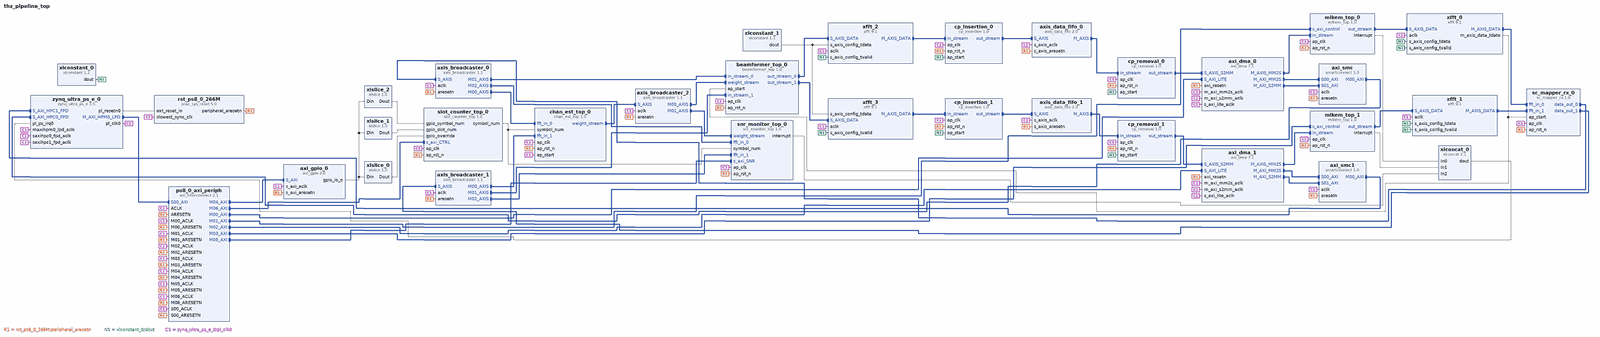
[diagram p0: block diagram of the top level, whole]
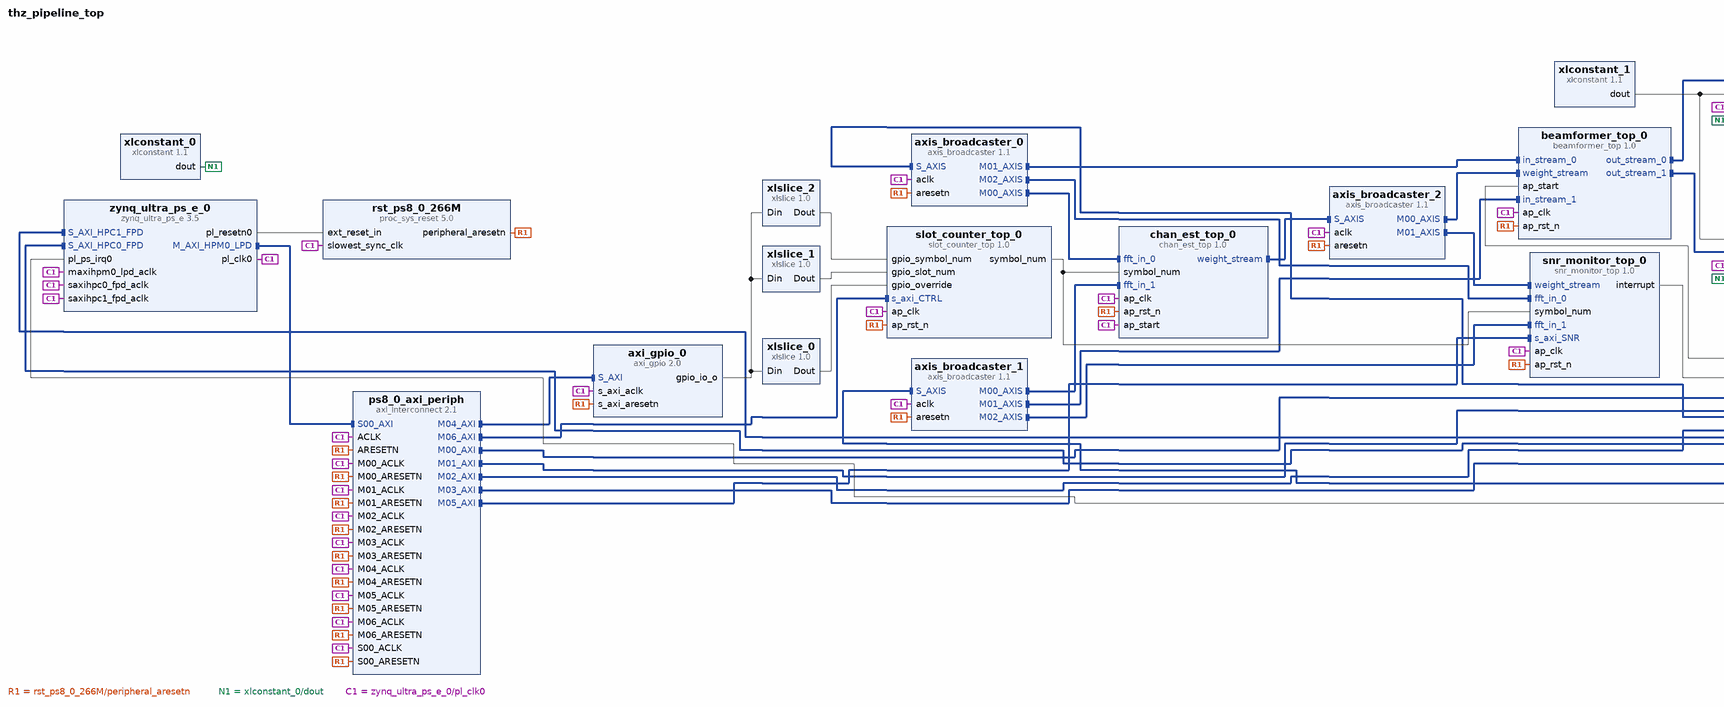
[diagram p1: block diagram of the top level, left part]
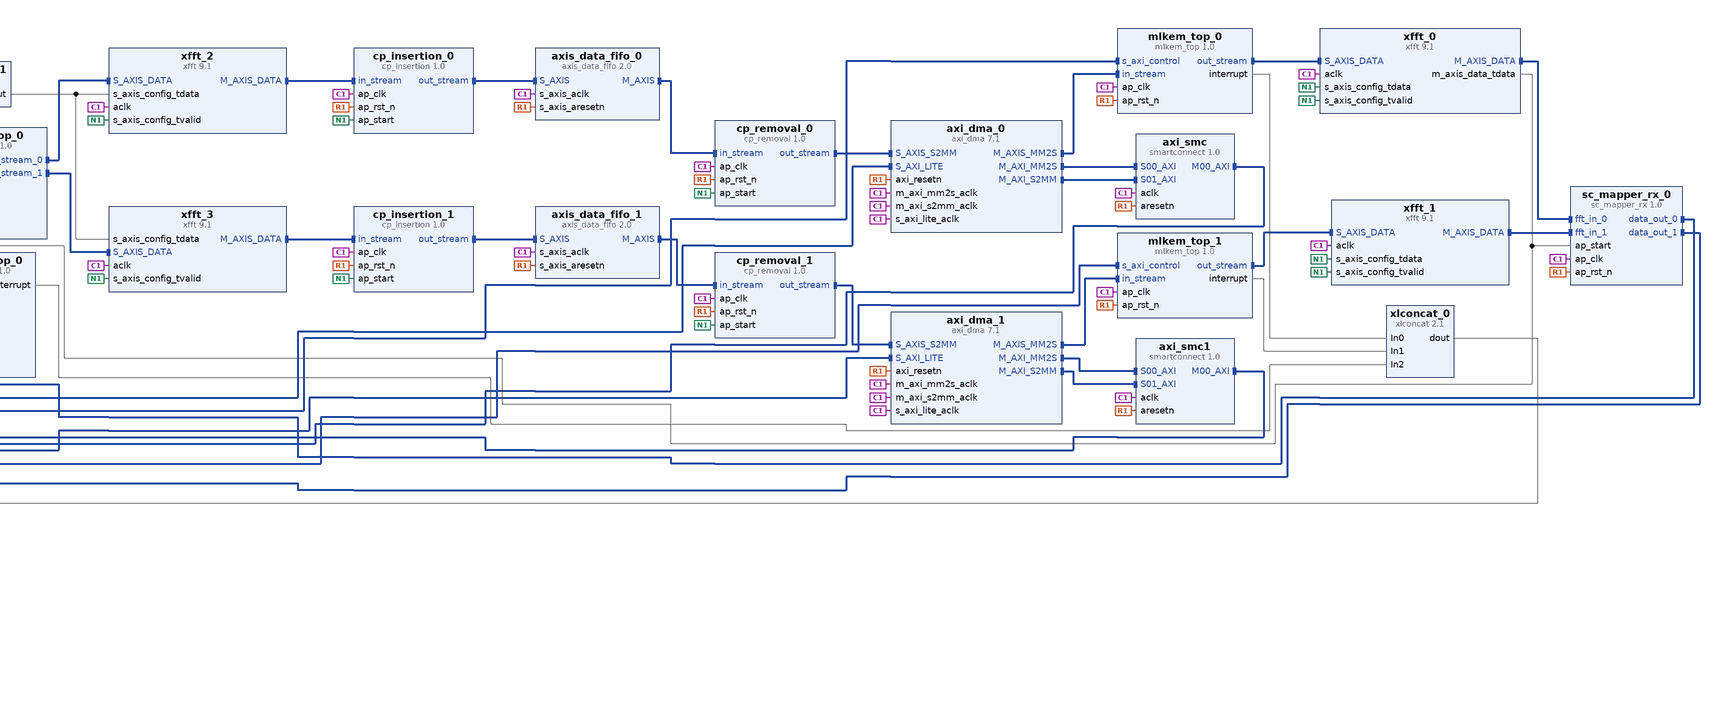
[diagram p2: block diagram of the top level, right part]
# Vivado block design thz_pipeline_top, xczu7ev-ffvc1156-2-e, Vivado 2024.1
create_bd_design thz_pipeline_top

create_bd_cell -type ip -vlnv xilinx.com:ip:smartconnect:1.0 axi_smc
set_property -dict {CONFIG.NUM_SI 2} [get_bd_cells axi_smc]
create_bd_cell -type ip -vlnv xilinx.com:ip:zynq_ultra_ps_e:3.5 zynq_ultra_ps_e_0
set_property -dict [list \
  CONFIG.PSU__CRL_APB__PL0_REF_CTRL__FREQMHZ 300 \
  CONFIG.PSU__CRL_APB__PL0_REF_CTRL__SRCSEL IOPLL \
  CONFIG.PSU__DDR_HIGH_ADDRESS_GUI_ENABLE 0 \
  CONFIG.PSU__OVERRIDE__BASIC_CLOCK 0 \
  CONFIG.PSU__USE__IRQ0 1 \
  CONFIG.PSU__USE__S_AXI_GP0 1 \
  CONFIG.PSU__USE__S_AXI_GP1 1 \
] [get_bd_cells zynq_ultra_ps_e_0]
# 31 more settings of zynq_ultra_ps_e_0 are not shown: defaults, MIO pin electricals, DDR timing, and values the tool derives
create_bd_cell -type ip -vlnv xilinx.com:ip:xfft:9.1 xfft_0
set_property -dict {CONFIG.run_time_configurable_transform_length true CONFIG.throttle_scheme realtime} [get_bd_cells xfft_0]
create_bd_cell -type ip -vlnv xilinx.com:ip:xlconstant:1.1 xlconstant_0
create_bd_cell -type ip -vlnv xilinx.com:ip:proc_sys_reset:5.0 rst_ps8_0_266M
create_bd_cell -type ip -vlnv xilinx.com:ip:axi_interconnect:2.1 ps8_0_axi_periph
set_property -dict {CONFIG.NUM_MI 7} [get_bd_cells ps8_0_axi_periph]
create_bd_cell -type ip -vlnv xilinx.com:ip:axis_data_fifo:2.0 axis_data_fifo_0
set_property -dict {CONFIG.FIFO_DEPTH 1024} [get_bd_cells axis_data_fifo_0]
create_bd_cell -type ip -vlnv xilinx.com:ip:xfft:9.1 xfft_1
set_property -dict {CONFIG.run_time_configurable_transform_length true CONFIG.throttle_scheme realtime} [get_bd_cells xfft_1]
create_bd_cell -type ip -vlnv xilinx.com:ip:axi_dma:7.1 axi_dma_0
set_property -dict {CONFIG.c_addr_width 40 CONFIG.c_include_sg 0 CONFIG.c_micro_dma 0} [get_bd_cells axi_dma_0]
create_bd_cell -type ip -vlnv xilinx.com:hls:mlkem_top:1.0 mlkem_top_0
create_bd_cell -type ip -vlnv xilinx.com:hls:mlkem_top:1.0 mlkem_top_1
create_bd_cell -type ip -vlnv xilinx.com:ip:axi_dma:7.1 axi_dma_1
set_property -dict {CONFIG.c_addr_width 40 CONFIG.c_include_sg 0 CONFIG.c_micro_dma 0} [get_bd_cells axi_dma_1]
create_bd_cell -type ip -vlnv xilinx.com:ip:smartconnect:1.0 axi_smc1
set_property -dict {CONFIG.NUM_SI 2} [get_bd_cells axi_smc1]
create_bd_cell -type ip -vlnv xilinx.com:ip:axis_data_fifo:2.0 axis_data_fifo_1
set_property -dict {CONFIG.FIFO_DEPTH 1024} [get_bd_cells axis_data_fifo_1]
create_bd_cell -type ip -vlnv xilinx.com:hls:beamformer_top:1.0 beamformer_top_0
create_bd_cell -type ip -vlnv xilinx.com:hls:cp_removal:1.0 cp_removal_0
create_bd_cell -type ip -vlnv xilinx.com:hls:cp_removal:1.0 cp_removal_1
create_bd_cell -type ip -vlnv xilinx.com:ip:xfft:9.1 xfft_2
set_property -dict {CONFIG.run_time_configurable_transform_length true CONFIG.throttle_scheme realtime} [get_bd_cells xfft_2]
create_bd_cell -type ip -vlnv xilinx.com:ip:xfft:9.1 xfft_3
set_property -dict {CONFIG.run_time_configurable_transform_length true CONFIG.throttle_scheme realtime} [get_bd_cells xfft_3]
create_bd_cell -type ip -vlnv xilinx.com:ip:xlconstant:1.1 xlconstant_1
set_property -dict {CONFIG.CONST_VAL 0} [get_bd_cells xlconstant_1]
create_bd_cell -type ip -vlnv xilinx.com:hls:cp_insertion:1.0 cp_insertion_0
create_bd_cell -type ip -vlnv xilinx.com:hls:cp_insertion:1.0 cp_insertion_1
create_bd_cell -type ip -vlnv xilinx.com:ip:axis_broadcaster:1.1 axis_broadcaster_0
set_property -dict {CONFIG.NUM_MI 3} [get_bd_cells axis_broadcaster_0]
create_bd_cell -type ip -vlnv xilinx.com:ip:axis_broadcaster:1.1 axis_broadcaster_1
set_property -dict {CONFIG.NUM_MI 3} [get_bd_cells axis_broadcaster_1]
create_bd_cell -type ip -vlnv xilinx.com:hls:chan_est_top:1.0 chan_est_top_0
create_bd_cell -type ip -vlnv xilinx.com:ip:axi_gpio:2.0 axi_gpio_0
set_property -dict {CONFIG.C_ALL_OUTPUTS 1 CONFIG.C_GPIO_WIDTH 12 CONFIG.C_IS_DUAL 0} [get_bd_cells axi_gpio_0]
create_bd_cell -type ip -vlnv xilinx.com:hls:sc_mapper_rx:1.0 sc_mapper_rx_0
create_bd_cell -type ip -vlnv xilinx.com:hls:snr_monitor_top:1.0 snr_monitor_top_0
create_bd_cell -type ip -vlnv xilinx.com:ip:axis_broadcaster:1.1 axis_broadcaster_2
set_property -dict {CONFIG.NUM_MI 2} [get_bd_cells axis_broadcaster_2]
create_bd_cell -type ip -vlnv xilinx.com:ip:xlconcat:2.1 xlconcat_0
set_property -dict {CONFIG.NUM_PORTS 3} [get_bd_cells xlconcat_0]
create_bd_cell -type ip -vlnv xilinx.com:hls:slot_counter_top:1.0 slot_counter_top_0
create_bd_cell -type ip -vlnv xilinx.com:ip:xlslice:1.0 xlslice_0
set_property -dict {CONFIG.DIN_WIDTH 12} [get_bd_cells xlslice_0]
create_bd_cell -type ip -vlnv xilinx.com:ip:xlslice:1.0 xlslice_1
set_property -dict {CONFIG.DIN_FROM 11 CONFIG.DIN_TO 5 CONFIG.DIN_WIDTH 12} [get_bd_cells xlslice_1]
create_bd_cell -type ip -vlnv xilinx.com:ip:xlslice:1.0 xlslice_2
set_property -dict {CONFIG.DIN_FROM 4 CONFIG.DIN_TO 1 CONFIG.DIN_WIDTH 12} [get_bd_cells xlslice_2]

# ---- connections ----

connect_bd_intf_net [get_bd_intf_pins axi_dma_0/M_AXIS_MM2S] [get_bd_intf_pins mlkem_top_0/in_stream]
connect_bd_intf_net [get_bd_intf_pins axi_smc/S00_AXI] [get_bd_intf_pins axi_dma_0/M_AXI_MM2S]
connect_bd_intf_net [get_bd_intf_pins axi_smc/S01_AXI] [get_bd_intf_pins axi_dma_0/M_AXI_S2MM]
connect_bd_intf_net [get_bd_intf_pins axi_dma_1/M_AXIS_MM2S] [get_bd_intf_pins mlkem_top_1/in_stream]
connect_bd_intf_net [get_bd_intf_pins axi_dma_1/M_AXI_MM2S] [get_bd_intf_pins axi_smc1/S00_AXI]
connect_bd_intf_net [get_bd_intf_pins axi_dma_1/M_AXI_S2MM] [get_bd_intf_pins axi_smc1/S01_AXI]
connect_bd_intf_net [get_bd_intf_pins axi_smc1/M00_AXI] [get_bd_intf_pins zynq_ultra_ps_e_0/S_AXI_HPC1_FPD]
connect_bd_intf_net [get_bd_intf_pins axi_smc/M00_AXI] [get_bd_intf_pins zynq_ultra_ps_e_0/S_AXI_HPC0_FPD]
connect_bd_intf_net [get_bd_intf_pins axis_broadcaster_0/M00_AXIS] [get_bd_intf_pins chan_est_top_0/fft_in_0]
connect_bd_intf_net [get_bd_intf_pins axis_broadcaster_0/M01_AXIS] [get_bd_intf_pins beamformer_top_0/in_stream_0]
connect_bd_intf_net [get_bd_intf_pins axis_broadcaster_0/M02_AXIS] [get_bd_intf_pins snr_monitor_top_0/fft_in_0]
connect_bd_intf_net [get_bd_intf_pins axis_broadcaster_1/M00_AXIS] [get_bd_intf_pins chan_est_top_0/fft_in_1]
connect_bd_intf_net [get_bd_intf_pins axis_broadcaster_1/M01_AXIS] [get_bd_intf_pins beamformer_top_0/in_stream_1]
connect_bd_intf_net [get_bd_intf_pins axis_broadcaster_1/M02_AXIS] [get_bd_intf_pins snr_monitor_top_0/fft_in_1]
connect_bd_intf_net [get_bd_intf_pins axis_broadcaster_2/M00_AXIS] [get_bd_intf_pins beamformer_top_0/weight_stream]
connect_bd_intf_net [get_bd_intf_pins axis_broadcaster_2/M01_AXIS] [get_bd_intf_pins snr_monitor_top_0/weight_stream]
connect_bd_intf_net [get_bd_intf_pins axis_data_fifo_0/M_AXIS] [get_bd_intf_pins cp_removal_0/in_stream]
connect_bd_intf_net [get_bd_intf_pins axis_data_fifo_1/M_AXIS] [get_bd_intf_pins cp_removal_1/in_stream]
connect_bd_intf_net [get_bd_intf_pins beamformer_top_0/out_stream_0] [get_bd_intf_pins xfft_2/S_AXIS_DATA]
connect_bd_intf_net [get_bd_intf_pins beamformer_top_0/out_stream_1] [get_bd_intf_pins xfft_3/S_AXIS_DATA]
connect_bd_intf_net [get_bd_intf_pins chan_est_top_0/weight_stream] [get_bd_intf_pins axis_broadcaster_2/S_AXIS]
connect_bd_intf_net [get_bd_intf_pins cp_insertion_0/out_stream] [get_bd_intf_pins axis_data_fifo_0/S_AXIS]
connect_bd_intf_net [get_bd_intf_pins cp_insertion_1/out_stream] [get_bd_intf_pins axis_data_fifo_1/S_AXIS]
connect_bd_intf_net [get_bd_intf_pins cp_removal_0/out_stream] [get_bd_intf_pins axi_dma_0/S_AXIS_S2MM]
connect_bd_intf_net [get_bd_intf_pins cp_removal_1/out_stream] [get_bd_intf_pins axi_dma_1/S_AXIS_S2MM]
connect_bd_intf_net [get_bd_intf_pins mlkem_top_0/out_stream] [get_bd_intf_pins xfft_0/S_AXIS_DATA]
connect_bd_intf_net [get_bd_intf_pins mlkem_top_1/out_stream] [get_bd_intf_pins xfft_1/S_AXIS_DATA]
connect_bd_intf_net [get_bd_intf_pins ps8_0_axi_periph/M00_AXI] [get_bd_intf_pins axi_dma_0/S_AXI_LITE]
connect_bd_intf_net [get_bd_intf_pins mlkem_top_0/s_axi_control] [get_bd_intf_pins ps8_0_axi_periph/M01_AXI]
connect_bd_intf_net [get_bd_intf_pins ps8_0_axi_periph/M02_AXI] [get_bd_intf_pins axi_dma_1/S_AXI_LITE]
connect_bd_intf_net [get_bd_intf_pins ps8_0_axi_periph/M03_AXI] [get_bd_intf_pins mlkem_top_1/s_axi_control]
connect_bd_intf_net [get_bd_intf_pins ps8_0_axi_periph/M04_AXI] [get_bd_intf_pins axi_gpio_0/S_AXI]
connect_bd_intf_net [get_bd_intf_pins ps8_0_axi_periph/M05_AXI] [get_bd_intf_pins snr_monitor_top_0/s_axi_SNR]
connect_bd_intf_net [get_bd_intf_pins ps8_0_axi_periph/M06_AXI] [get_bd_intf_pins slot_counter_top_0/s_axi_CTRL]
connect_bd_intf_net [get_bd_intf_pins sc_mapper_rx_0/data_out_0] [get_bd_intf_pins axis_broadcaster_0/S_AXIS]
connect_bd_intf_net [get_bd_intf_pins sc_mapper_rx_0/data_out_1] [get_bd_intf_pins axis_broadcaster_1/S_AXIS]
connect_bd_intf_net [get_bd_intf_pins xfft_0/M_AXIS_DATA] [get_bd_intf_pins sc_mapper_rx_0/fft_in_0]
connect_bd_intf_net [get_bd_intf_pins xfft_1/M_AXIS_DATA] [get_bd_intf_pins sc_mapper_rx_0/fft_in_1]
connect_bd_intf_net [get_bd_intf_pins xfft_2/M_AXIS_DATA] [get_bd_intf_pins cp_insertion_0/in_stream]
connect_bd_intf_net [get_bd_intf_pins xfft_3/M_AXIS_DATA] [get_bd_intf_pins cp_insertion_1/in_stream]
connect_bd_intf_net [get_bd_intf_pins zynq_ultra_ps_e_0/M_AXI_HPM0_LPD] [get_bd_intf_pins ps8_0_axi_periph/S00_AXI]
connect_bd_net [get_bd_pins slot_counter_top_0/symbol_num] [get_bd_pins snr_monitor_top_0/symbol_num] [get_bd_pins chan_est_top_0/symbol_num]
connect_bd_net [get_bd_pins axi_gpio_0/gpio_io_o] [get_bd_pins xlslice_0/Din] [get_bd_pins xlslice_1/Din] [get_bd_pins xlslice_2/Din]
connect_bd_net [get_bd_pins mlkem_top_0/interrupt] [get_bd_pins xlconcat_0/In0]
connect_bd_net [get_bd_pins mlkem_top_1/interrupt] [get_bd_pins xlconcat_0/In1]
connect_bd_net [get_bd_pins rst_ps8_0_266M/peripheral_aresetn] \
  [get_bd_pins axi_smc/aresetn] [get_bd_pins ps8_0_axi_periph/S00_ARESETN] [get_bd_pins ps8_0_axi_periph/M00_ARESETN] \
  [get_bd_pins ps8_0_axi_periph/M01_ARESETN] [get_bd_pins ps8_0_axi_periph/ARESETN] \
  [get_bd_pins axis_data_fifo_0/s_axis_aresetn] [get_bd_pins axi_dma_0/axi_resetn] [get_bd_pins ps8_0_axi_periph/M02_ARESETN] \
  [get_bd_pins ps8_0_axi_periph/M03_ARESETN] [get_bd_pins axi_smc1/aresetn] [get_bd_pins axi_dma_1/axi_resetn] \
  [get_bd_pins axis_data_fifo_1/s_axis_aresetn] [get_bd_pins axis_broadcaster_0/aresetn] \
  [get_bd_pins axis_broadcaster_1/aresetn] [get_bd_pins ps8_0_axi_periph/M04_ARESETN] [get_bd_pins axi_gpio_0/s_axi_aresetn] \
  [get_bd_pins beamformer_top_0/ap_rst_n] [get_bd_pins cp_insertion_0/ap_rst_n] [get_bd_pins cp_insertion_1/ap_rst_n] \
  [get_bd_pins cp_removal_0/ap_rst_n] [get_bd_pins cp_removal_1/ap_rst_n] [get_bd_pins mlkem_top_0/ap_rst_n] \
  [get_bd_pins mlkem_top_1/ap_rst_n] [get_bd_pins sc_mapper_rx_0/ap_rst_n] [get_bd_pins chan_est_top_0/ap_rst_n] \
  [get_bd_pins snr_monitor_top_0/ap_rst_n] [get_bd_pins axis_broadcaster_2/aresetn] \
  [get_bd_pins ps8_0_axi_periph/M05_ARESETN] [get_bd_pins slot_counter_top_0/ap_rst_n] \
  [get_bd_pins ps8_0_axi_periph/M06_ARESETN]
connect_bd_net [get_bd_pins snr_monitor_top_0/interrupt] [get_bd_pins xlconcat_0/In2]
connect_bd_net [get_bd_pins xfft_0/m_axis_data_tdata] [get_bd_pins beamformer_top_0/ap_start] [get_bd_pins sc_mapper_rx_0/ap_start]
connect_bd_net [get_bd_pins xlconcat_0/dout] [get_bd_pins zynq_ultra_ps_e_0/pl_ps_irq0]
connect_bd_net [get_bd_pins xlconstant_0/dout] \
  [get_bd_pins xfft_0/s_axis_config_tdata] [get_bd_pins xfft_0/s_axis_config_tvalid] [get_bd_pins xfft_1/s_axis_config_tdata] \
  [get_bd_pins xfft_1/s_axis_config_tvalid] [get_bd_pins xfft_2/s_axis_config_tvalid] \
  [get_bd_pins xfft_3/s_axis_config_tvalid] [get_bd_pins cp_insertion_0/ap_start] [get_bd_pins cp_insertion_1/ap_start] \
  [get_bd_pins cp_removal_0/ap_start] [get_bd_pins cp_removal_1/ap_start]
connect_bd_net [get_bd_pins xlconstant_1/dout] [get_bd_pins xfft_2/s_axis_config_tdata] [get_bd_pins xfft_3/s_axis_config_tdata]
connect_bd_net [get_bd_pins xlslice_0/Dout] [get_bd_pins slot_counter_top_0/gpio_override]
connect_bd_net [get_bd_pins xlslice_1/Dout] [get_bd_pins slot_counter_top_0/gpio_slot_num]
connect_bd_net [get_bd_pins xlslice_2/Dout] [get_bd_pins slot_counter_top_0/gpio_symbol_num]
connect_bd_net [get_bd_pins zynq_ultra_ps_e_0/pl_clk0] \
  [get_bd_pins zynq_ultra_ps_e_0/maxihpm0_lpd_aclk] [get_bd_pins rst_ps8_0_266M/slowest_sync_clk] [get_bd_pins axi_smc/aclk] \
  [get_bd_pins zynq_ultra_ps_e_0/saxihpc0_fpd_aclk] [get_bd_pins xfft_0/aclk] [get_bd_pins ps8_0_axi_periph/S00_ACLK] \
  [get_bd_pins ps8_0_axi_periph/M00_ACLK] [get_bd_pins ps8_0_axi_periph/M01_ACLK] [get_bd_pins ps8_0_axi_periph/ACLK] \
  [get_bd_pins axis_data_fifo_0/s_axis_aclk] [get_bd_pins xfft_1/aclk] [get_bd_pins axi_dma_0/s_axi_lite_aclk] \
  [get_bd_pins axi_dma_0/m_axi_s2mm_aclk] [get_bd_pins axi_dma_0/m_axi_mm2s_aclk] [get_bd_pins ps8_0_axi_periph/M02_ACLK] \
  [get_bd_pins ps8_0_axi_periph/M03_ACLK] [get_bd_pins zynq_ultra_ps_e_0/saxihpc1_fpd_aclk] [get_bd_pins axi_smc1/aclk] \
  [get_bd_pins axi_dma_1/s_axi_lite_aclk] [get_bd_pins axi_dma_1/m_axi_s2mm_aclk] [get_bd_pins axi_dma_1/m_axi_mm2s_aclk] \
  [get_bd_pins axis_data_fifo_1/s_axis_aclk] [get_bd_pins xfft_3/aclk] [get_bd_pins xfft_2/aclk] \
  [get_bd_pins axis_broadcaster_0/aclk] [get_bd_pins axis_broadcaster_1/aclk] [get_bd_pins ps8_0_axi_periph/M04_ACLK] \
  [get_bd_pins axi_gpio_0/s_axi_aclk] [get_bd_pins beamformer_top_0/ap_clk] [get_bd_pins cp_insertion_0/ap_clk] \
  [get_bd_pins cp_insertion_1/ap_clk] [get_bd_pins cp_removal_0/ap_clk] [get_bd_pins cp_removal_1/ap_clk] \
  [get_bd_pins mlkem_top_0/ap_clk] [get_bd_pins mlkem_top_1/ap_clk] [get_bd_pins sc_mapper_rx_0/ap_clk] \
  [get_bd_pins chan_est_top_0/ap_clk] [get_bd_pins chan_est_top_0/ap_start] [get_bd_pins snr_monitor_top_0/ap_clk] \
  [get_bd_pins axis_broadcaster_2/aclk] [get_bd_pins ps8_0_axi_periph/M05_ACLK] [get_bd_pins slot_counter_top_0/ap_clk] \
  [get_bd_pins ps8_0_axi_periph/M06_ACLK]
connect_bd_net [get_bd_pins zynq_ultra_ps_e_0/pl_resetn0] [get_bd_pins rst_ps8_0_266M/ext_reset_in]

# ---- address map ----
assign_bd_address -offset 0x0000000000 -range 2G -target_address_space [get_bd_addr_spaces axi_dma_0/Data_MM2S] [get_bd_addr_segs zynq_ultra_ps_e_0/SAXIGP0/HPC0_DDR_LOW]
assign_bd_address -offset 0x00FF000000 -range 16M -target_address_space [get_bd_addr_spaces axi_dma_0/Data_MM2S] [get_bd_addr_segs zynq_ultra_ps_e_0/SAXIGP0/HPC0_LPS_OCM]
assign_bd_address -offset 0x0000000000 -range 2G -target_address_space [get_bd_addr_spaces axi_dma_0/Data_S2MM] [get_bd_addr_segs zynq_ultra_ps_e_0/SAXIGP0/HPC0_DDR_LOW]
assign_bd_address -offset 0x00FF000000 -range 16M -target_address_space [get_bd_addr_spaces axi_dma_0/Data_S2MM] [get_bd_addr_segs zynq_ultra_ps_e_0/SAXIGP0/HPC0_LPS_OCM]
assign_bd_address -offset 0x0000000000 -range 2G -target_address_space [get_bd_addr_spaces axi_dma_1/Data_MM2S] [get_bd_addr_segs zynq_ultra_ps_e_0/SAXIGP1/HPC1_DDR_LOW]
exclude_bd_addr_seg -offset 0x00FF000000 -range 16M -target_address_space [get_bd_addr_spaces axi_dma_1/Data_MM2S] [get_bd_addr_segs zynq_ultra_ps_e_0/SAXIGP1/HPC1_LPS_OCM]
assign_bd_address -offset 0x0000000000 -range 2G -target_address_space [get_bd_addr_spaces axi_dma_1/Data_S2MM] [get_bd_addr_segs zynq_ultra_ps_e_0/SAXIGP1/HPC1_DDR_LOW]
exclude_bd_addr_seg -offset 0x00FF000000 -range 16M -target_address_space [get_bd_addr_spaces axi_dma_1/Data_S2MM] [get_bd_addr_segs zynq_ultra_ps_e_0/SAXIGP1/HPC1_LPS_OCM]
assign_bd_address -offset 0x0080000000 -range 64K -target_address_space [get_bd_addr_spaces zynq_ultra_ps_e_0/Data] [get_bd_addr_segs axi_dma_0/S_AXI_LITE/Reg]
assign_bd_address -offset 0x0080010000 -range 64K -target_address_space [get_bd_addr_spaces zynq_ultra_ps_e_0/Data] [get_bd_addr_segs axi_gpio_0/S_AXI/Reg]
assign_bd_address -offset 0x0080020000 -range 64K -target_address_space [get_bd_addr_spaces zynq_ultra_ps_e_0/Data] [get_bd_addr_segs axi_dma_1/S_AXI_LITE/Reg]
assign_bd_address -offset 0x0080030000 -range 64K -target_address_space [get_bd_addr_spaces zynq_ultra_ps_e_0/Data] [get_bd_addr_segs mlkem_top_0/s_axi_control/Reg]
assign_bd_address -offset 0x0080040000 -range 64K -target_address_space [get_bd_addr_spaces zynq_ultra_ps_e_0/Data] [get_bd_addr_segs mlkem_top_1/s_axi_control/Reg]
assign_bd_address -offset 0x0080050000 -range 64K -target_address_space [get_bd_addr_spaces zynq_ultra_ps_e_0/Data] [get_bd_addr_segs snr_monitor_top_0/s_axi_SNR/Reg]
assign_bd_address -offset 0x0080060000 -range 64K -target_address_space [get_bd_addr_spaces zynq_ultra_ps_e_0/Data] [get_bd_addr_segs slot_counter_top_0/s_axi_CTRL/Reg]

validate_bd_design
save_bd_design
